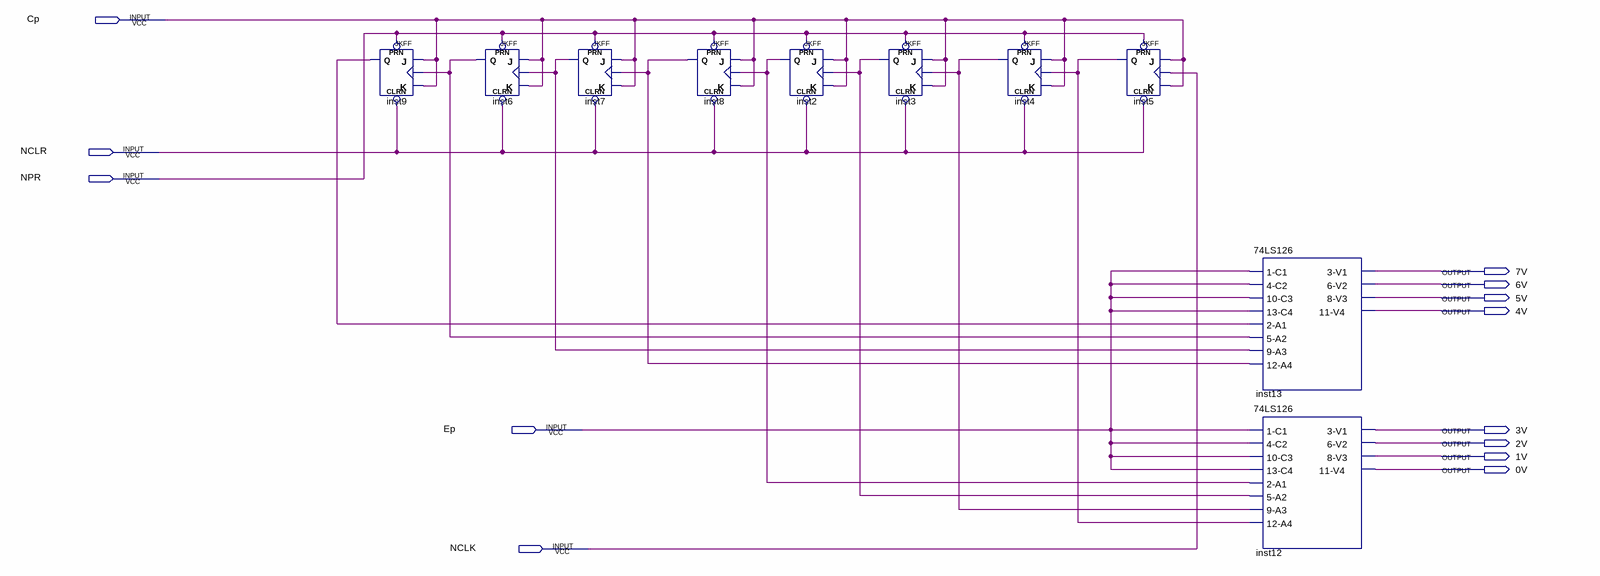
[diagram p0: schematic sheet]
// Quartus schematic Cont.bdf as structural Verilog: 10 symbols, 13 pins
module Cont (
  input  Cp,
  input  NCLR,
  input  NPR,
  input  Ep,
  input  NCLK,
  output \7V ,
  output \6V ,
  output \5V ,
  output \4V ,
  output \3V ,
  output \2V ,
  output \1V ,
  output \0V 
);

  wire inst2_q, inst3_q, inst4_q, inst5_q, inst6_q, inst7_q, inst8_q, inst9_q;

  JKFF inst9 (.PRN(NPR), .CLRN(NCLR), .K(Cp), .J(Cp), .CLK(inst6_q), .Q(inst9_q));
  JKFF inst6 (.PRN(NPR), .CLRN(NCLR), .K(Cp), .J(Cp), .CLK(inst7_q), .Q(inst6_q));
  JKFF inst7 (.PRN(NPR), .CLRN(NCLR), .K(Cp), .J(Cp), .CLK(inst8_q), .Q(inst7_q));
  JKFF inst8 (.PRN(NPR), .CLRN(NCLR), .K(Cp), .J(Cp), .CLK(inst2_q), .Q(inst8_q));
  JKFF inst2 (.PRN(NPR), .CLRN(NCLR), .K(Cp), .J(Cp), .CLK(inst3_q), .Q(inst2_q));
  JKFF inst3 (.PRN(NPR), .CLRN(NCLR), .K(Cp), .J(Cp), .CLK(inst4_q), .Q(inst3_q));
  JKFF inst4 (.PRN(NPR), .CLRN(NCLR), .K(Cp), .J(Cp), .CLK(inst5_q), .Q(inst4_q));
  JKFF inst5 (.PRN(NPR), .CLRN(NCLR), .K(Cp), .J(Cp), .CLK(NCLK), .Q(inst5_q));
  \74LS126  inst13 (
    .\1-C1 (Ep), .\4-C2 (Ep), .\10-C3 (Ep), .\13-C4 (Ep), .\2-A1 (inst9_q), .\5-A2 (inst6_q),
    .\9-A3 (inst7_q), .\12-A4 (inst8_q), .\3-V1 (\7V ), .\6-V2 (\6V ), .\8-V3 (\5V ), .\11-V4 (\4V ));
  \74LS126  inst12 (
    .\1-C1 (Ep), .\4-C2 (Ep), .\10-C3 (Ep), .\13-C4 (Ep), .\2-A1 (inst2_q), .\5-A2 (inst3_q),
    .\9-A3 (inst4_q), .\12-A4 (inst5_q), .\3-V1 (\3V ), .\6-V2 (\2V ), .\8-V3 (\1V ), .\11-V4 (\0V ));
endmodule
